# Altium schematic sheet TP2.SchDoc
size A4
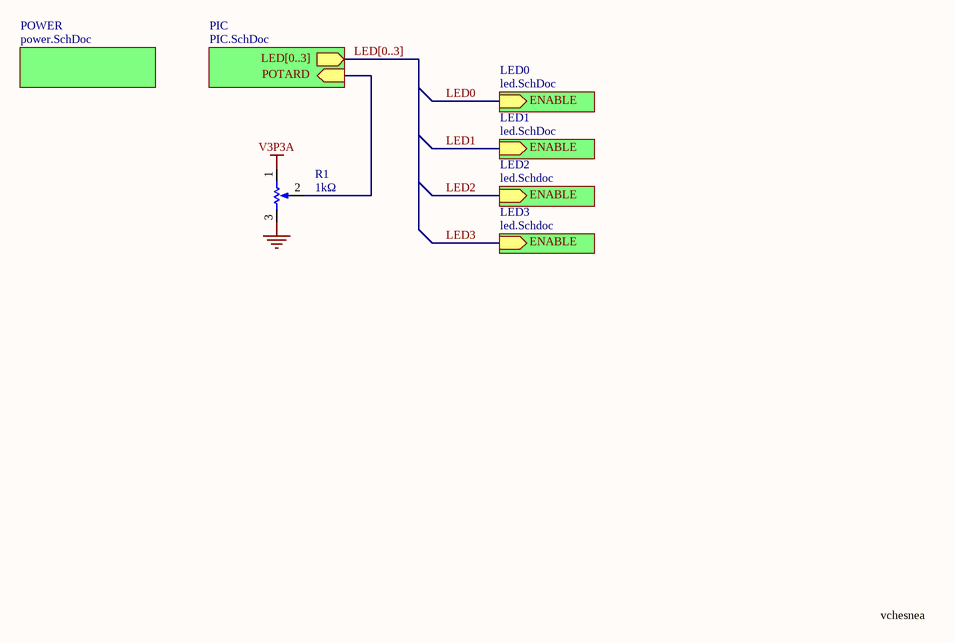
[diagram p0: TP2.SchDoc]

## Parts
R1  1kΩ  [PDB181-K415K-102A2]

## Sub-sheets
LED0 = led.SchDoc: no entries
LED1 = led.SchDoc: no entries
LED2 = led.Schdoc: no entries
LED3 = led.Schdoc: no entries
PIC = PIC.SchDoc: no entries
POWER = power.SchDoc: no entries

## Ports
 (in),  (out), 

## Nets
+12: R1.3(TOP)
V3P3A: R1.1(BOT)
LED0: R1.2(TAP) ; port   [also labelled LED1, LED2, LED3]

## Buses and harness runs
bus LED[0..3]
bus LED[0..3] = port 

## Notes on the sheet
- vchesnea
- Labels drawn without touching a wire or pin: ENABLE, LED[0..3], POTARD
- Title
- Size:
- Date:
- A4
- Number:
- Time:
- Revision:
- Sheet
- of
- File:

## Library data of the parts
R1 = RPot: Potentiometer; Sim Note: Enter the Resistance value and the set point into parameter fields.; Set Position: 0.5; Value: 1K; Fournisseur: Farnell; Fabricant: BOURNS; RefFournisseur: 1823540; Published: 8-Jun-2000; LatestRevisionDate: 17-Jul-2002; LatestRevisionNote: Re-released for DXP Platform.; PackageReference: VR5; Publisher: Altium Limited; PackageDescription: Variable Resistor, Thru-Hole; 3 Leads; RefFabricant: PDB181-K415K-102A2